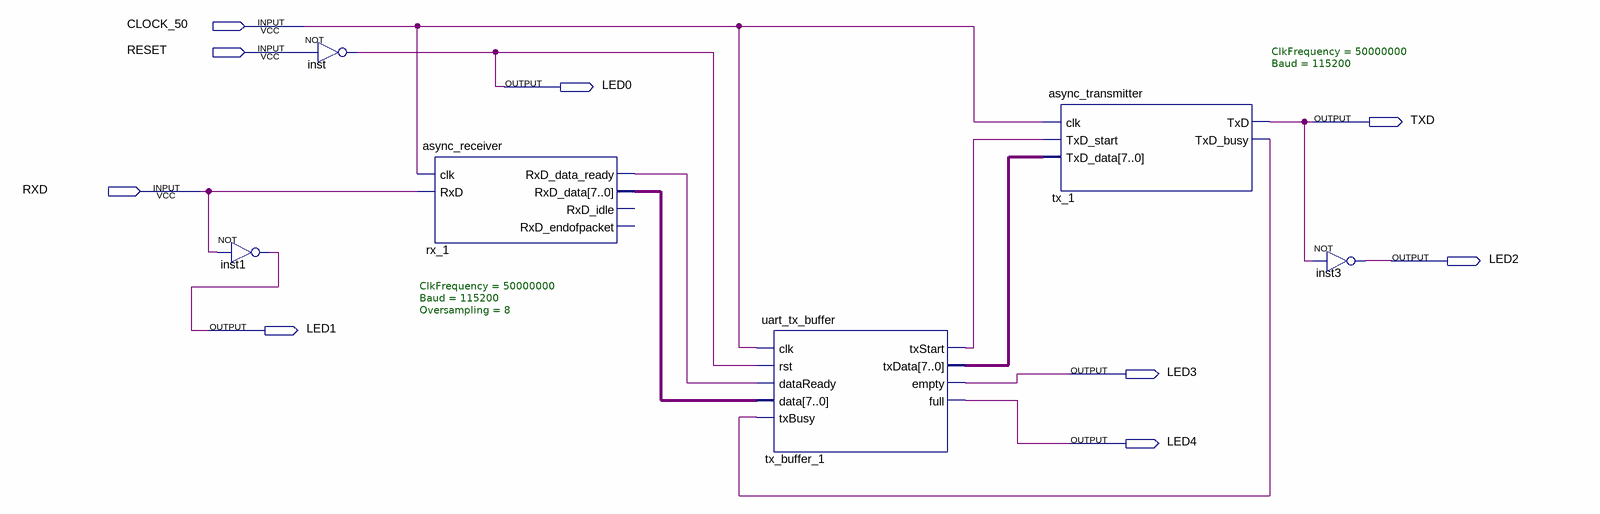
[diagram p0: schematic sheet]
// Quartus schematic uart_buffered.bdf as structural Verilog: 6 symbols, 9 pins
module uart_buffered (
  input  CLOCK_50,
  input  RESET,
  input  RXD,
  output LED0,
  output TXD,
  output LED2,
  output LED1,
  output LED3,
  output LED4
);

  wire rx_1_rxd_data_ready, tx_1_txd_busy, tx_buffer_1_txstart;
  wire [7:0] rx_1_rxd_data, tx_buffer_1_txdata;

  not inst1 (LED1, RXD);
  not inst (LED0, RESET);
  async_receiver #(.ClkFrequency(50000000), .Baud(115200), .Oversampling(8)) rx_1 (
    .clk(CLOCK_50), .RxD(RXD), .RxD_data_ready(rx_1_rxd_data_ready), .RxD_data(rx_1_rxd_data));  // open: RxD_idle, RxD_endofpacket
  uart_tx_buffer tx_buffer_1 (
    .clk(CLOCK_50), .rst(LED0), .dataReady(rx_1_rxd_data_ready), .data(rx_1_rxd_data),
    .txBusy(tx_1_txd_busy), .txStart(tx_buffer_1_txstart), .txData(tx_buffer_1_txdata), .empty(LED3),
    .full(LED4));
  async_transmitter #(.ClkFrequency(50000000), .Baud(115200)) tx_1 (
    .clk(CLOCK_50), .TxD_start(tx_buffer_1_txstart), .TxD_data(tx_buffer_1_txdata), .TxD(TXD),
    .TxD_busy(tx_1_txd_busy));
  not inst3 (LED2, TXD);
endmodule
